# Altium project 101000100.PrjPcb
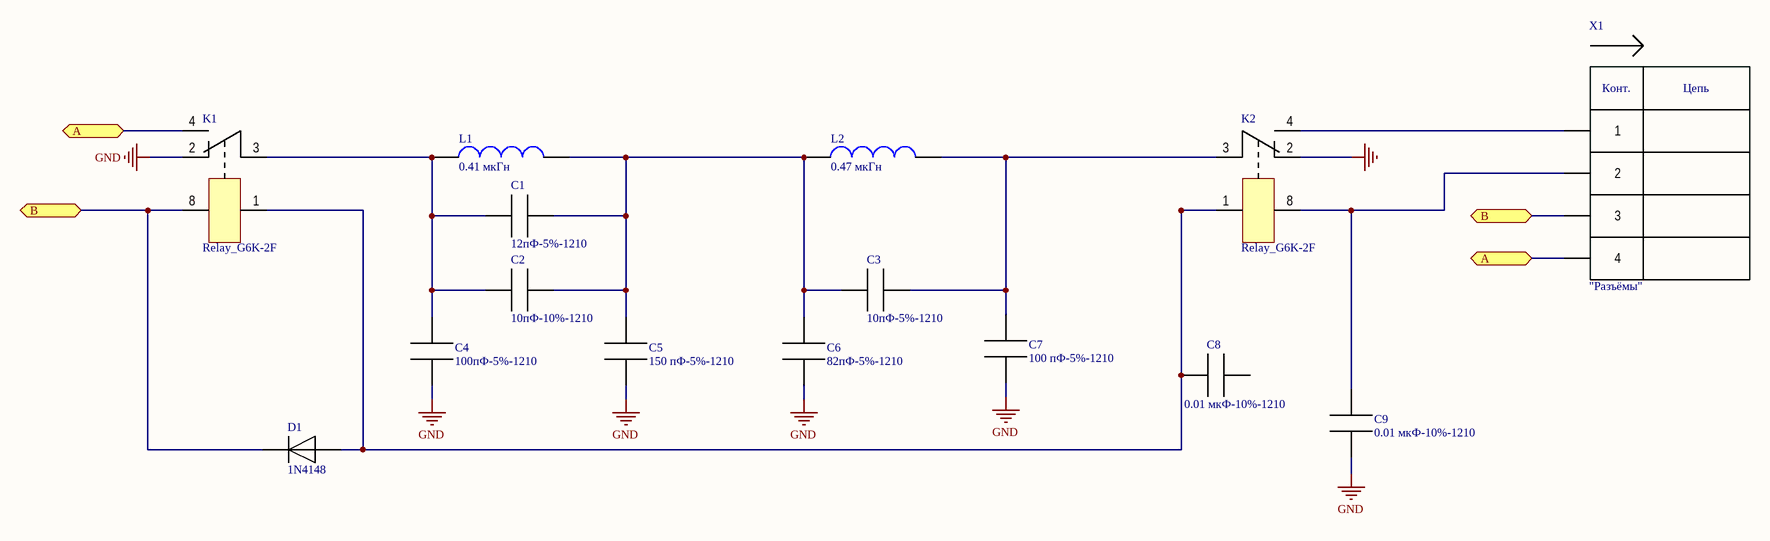
[diagram p0: Sheet1.SchDoc]
1 sheet, 15 parts. Net scope: flat (ports and power ports of the same name join across sheets).
Board file: PCB1.PcbDoc

## Sheet Sheet1.SchDoc: Плата фильтра
size 420 x 297 mm; CheckedBy: Бойков; Author: Чебан; CompanyName: РРБО-02-24; Address1: Address1; Address2: Address2; Address3: Address3; Address4: Address4; DocumentNumber: МРАГ.1122.1200 Э3; SheetNumber: 1; Title2str: 18/21 мГц; DocumentType: Схема электрическая принципиальная; FirstReferrence: МРАГ.1122.1000

### Parts
C1  12пФ-5%-1210  [Capacitor_0805]
C2  10пФ-10%-1210  [Capacitor_0805]
C3  10пФ-5%-1210  [Capacitor_0805]
C4  100пФ-5%-1210  [Capacitor_0805]
C5  150 пФ-5%-1210  [Capacitor_0805]
C6  82пФ-5%-1210  [Capacitor_0805]
C7  100 пФ-5%-1210  [Capacitor_0805]
C8  0.01 мкФ-10%-1210  [Capacitor_0805]
C9  0.01 мкФ-10%-1210  [Capacitor_0805]
D1  1N4148  [1N4148_MELF]
K1  Relay_G6K-2F  [Relay_G6K-2F]
K2  Relay_G6K-2F  [Relay_G6K-2F]
L1  0.41 мкГн  [Inductor_1210L]
L2  0.47 мкГн  [Inductor_1210L]
X1  "Разъёмы"  [PLS-1x4]

### Ports
A, B

### Nets
GND: C4.0 C5.0 C6.0 C7.1 C9.0 K1.2
NetC1_0: C1.0 C2.0 C4.1 K1.3 L1.1
NetC1_1: C1.1 C2.1 C3.0 C5.1 C6.1 L1.2 L2.1
NetC3_1: C3.1 C7.0 K2.3 L2.2
NetC8_0: C8.0 D1.1 K1.1(plus) K2.1(plus)
NetC9_1: C9.1 K2.8(minus) X1.2
NetD1_2: D1.2 K1.8(minus) X1.3 ; port B
NetK1_4: K1.4 X1.4 ; port A
NetK2_4: K2.4 X1.1

Not connected (* = marked no-connect by the designer): C8 1; K2 2

### Notes on the sheet
- Перв. примен.
- Справ. №
- Подп. и дата
- Инв. № дубл.
- Взам. инв. №
- Разраб.
- Изм.
- Лист
- № докум.
- Подп.
- Дата
- Лит.
- Масса
- Масштаб
- Пров.
- Т.контр.
- Листов
- Инв. № подл.
- Утв.
- Н.контр.
- 2.106-A3
- Копировал
- Формат А3
- (in symbol PLS-1x4) Конт.; Цепь

### Library data of the parts
C1 = Capasitor_SMD1210C: Manufacturer: Kyocera AVX; PartNumber: KGQ32DCG2D120JT; Href: https://www.chipdip.ru/product0/8044209417
C2 C3 = Capasitor_SMD1210C: Manufacturer: Kemet Electronics; PartNumber: C1210C100K9RACTU; Href: https://www.chipdip.ru/product0/8018630498
C4 C7 = Capasitor_SMD1210C: Manufacturer: Murata Electronics; PartNumber: GRM32A7U3D101JW31D; Href: https://www.chipdip.ru/product0/8015826902
C5 = Capasitor_SMD1210C: Manufacturer: Kemet Electronics; PartNumber: C1210X151J1HACAUTO; Href: https://www.chipdip.ru/product0/8007765044
C6 = Capasitor_SMD1210C: Manufacturer: Murata Electronics; PartNumber: GRM32A7U3D820JW31D; Href: https://www.chipdip.ru/product0/8006256032
C8 C9 = Capasitor_SMD1210C: Manufacturer: Murata Electronics; PartNumber: GRM32DR72E104KW01L; Href: https://www.chipdip.ru/product/grm32dr72e104k
D1 = Diode_1N4148: Manufacturer: *; Href: *; PartNumber: *; Value: 1N4148
L1 L2 = Inductor_1210
X1 = PLS-1x4: PartNumber: DS-1021-1x4SF11-B; Href: https://www.chipdip.ru/product/pls-4?utm_source=direct&utm_medium=cpc&utm_campaign=Y_dinamicheskaya&utm_content=text1_ya&utm_term=---autotargeting&position_type=premium&yclid=14280046024007876607